# Altium schematic sheet usb_husb238a.SchDoc
size A
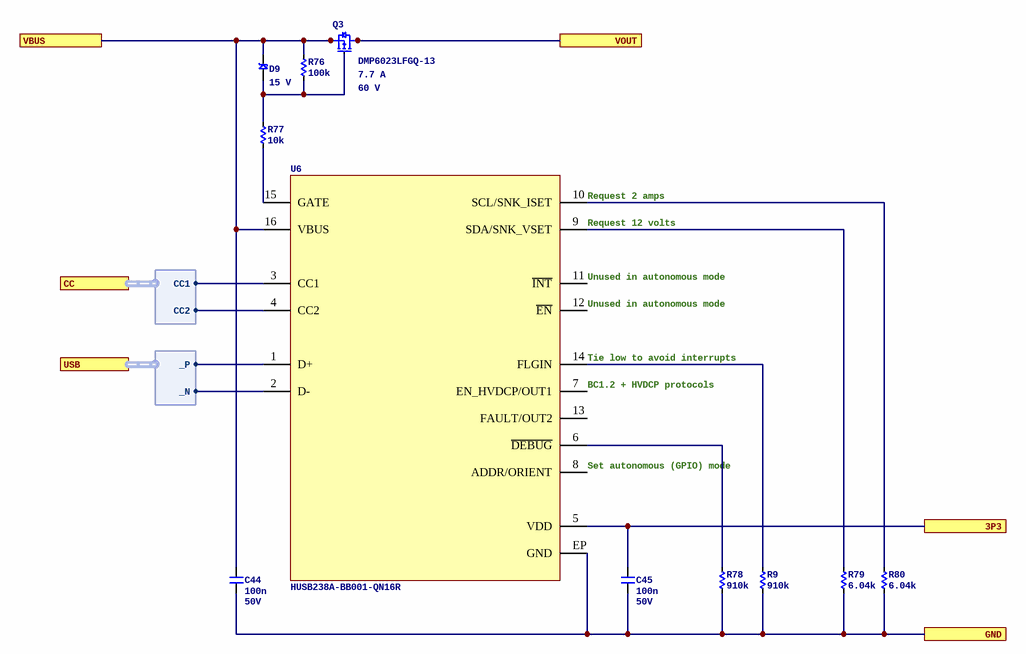
[diagram p0: usb_husb238a.SchDoc]

## Parts
C44  Capacitance: 100n  Voltage Rating: 50V  [C0402]  (hidden comment: CL05B104KB54PNC)
C45  Capacitance: 100n  Voltage Rating: 50V  [C0402]  (hidden comment: CL05B104KB54PNC)
D9  Voltage - Zener (Nom) (Vz): 15 V  [SOD323]  (hidden comment: MM3Z15VC)
Q3  DMP6023LFGQ-13  Current: 7.7 A  Voltage: 60 V  [DIODES_POWERDI3333-8]
R9  value 910k  [R0402]  (hidden comment: 0402WGF9103TCE)
R76  value 100k  [R0402]  (hidden comment: 0402WGF1003TCE)
R77  value 10k  [R0402]  (hidden comment: 0402WGF1002TCE)
R78  value 910k  [R0402]  (hidden comment: 0402WGF9103TCE)
R79  value 6.04k  [R0402]  (hidden comment: 0402WGF6041TCE)
R80  value 6.04k  [R0402]  (hidden comment: 0402WGF6041TCE)
U6  HUSB238A-BB001-QN16R  [QFN50P300X300X90-16N]

## Ports
3P3, CC (harness CC), GND, USB (harness DIFF), VBUS, VOUT

## Harnesses
CC: CC2, CC1
DIFF: _P, _N

## Nets
3P3: C45.1 U6.5(VDD) ; port 3P3
GND: C44.2 C45.2 R9.1 R78.1 R79.1 R80.1 U6.EP(GND) ; port GND
VBUS: C44.1 D9.2 Q3.1 Q3.2 Q3.3 R76.2 U6.16(VBUS) ; port VBUS
VOUT: Q3.5 Q3.6 Q3.7 Q3.8 ; port VOUT
NetD9_1: D9.1 Q3.4 R76.1 R77.2
NetR9_2: R9.2 U6.14(FLGIN)
NetR77_1: R77.1 U6.15(GATE)
NetR78_2: R78.2 U6.6(~{DEBUG})
NetR79_2: R79.2 U6.9(SDA/SNK_VSET)
NetR80_2: R80.2 U6.10(SCL/SNK_ISET)
NetU6_1: U6.1(D+) ; port USB._P
NetU6_2: U6.2(D-) ; port USB._N
NetU6_3: U6.3(CC1) ; port CC.CC1
NetU6_4: U6.4(CC2) ; port CC.CC2

Not connected (* = marked no-connect by the designer): U6 7(EN_HVDCP/OUT1) 8(ADDR/ORIENT) 11(~{INT}) 12(~{EN}) 13(FAULT/OUT2)

## Notes on the sheet
- (near U6) Request 2 amps
- (near U6) Request 12 volts
- (near U6) Unused in autonomous mode
- (near U6) BC1.2 + HVDCP protocols
- (near U6) Tie low to avoid interrupts
- (near U6) Set autonomous (GPIO) mode

## Library data of the parts
C44 C45 = CL05B104KB54PNC: Manufacturer: Samsung Electro-Mechanics; Dielectric: X7R; ComponentLink1URL: https://wmsc.lcsc.com/wmsc/upload/file/pdf/v2/lcsc/2304140030_Samsung-Electro-Mechanics-CL05B104KB54PNC_C307331.pdf; ComponentLink1Description: Datasheet; Manufacturer Part Number: CL05B104KB54PNC; Package: 0402; Supplier 2: LCSC; Supplier Part Number 2: C307331
D9 = ZENER_MM3Z15VC: DIODE ZENER 15V 200MW SOD; Manufacturer: onsemi; Supplier 1: Digikey; Manufacturer Part Number: MM3Z15VC; ComponentLink1URL: https://www.onsemi.com/pdf/datasheet/mm3z9v1c-d.pdf; ComponentLink1Description: Datasheet; Supplier Part Number 1: MM3Z15VCCT-ND; Supplier 2: LCSC; Supplier Part Number 2: C891582
Q3 = PFET_60V_DMP6023LFGQ-13: Small Signal Field-Effect Transistor, 7.7A I(D), 60V, 1-Element, P-Channel, Silicon, Metal-oxide Semiconductor FET; Manufacturer: Diodes; Supplier 1: Digikey; Supplier Part Number 1: 31-DMP6023LFGQ-13CT-ND; Manufacturer Part Number: DMP6023LFGQ-13; ComponentLink1Description: Datasheet; ComponentLink1URL: https://www.diodes.com/assets/Datasheets/DMP6023LFGQ.pdf; Supplier 2: LCSC; Supplier Part Number 2: C672173
R9 R78 = 0402WGF9103TCE: Manufacturer: UNI-ROYAL(Uniroyal Elec); Tolerance: 1%; Temperature Coefficient: Â±100ppm/â„ƒ; Power Rating (mW): 62.5; ComponentLink1Description: Datasheet; ComponentLink1URL: https://wmsc.lcsc.com/wmsc/upload/file/pdf/v2/lcsc/2206010045_UNI-ROYAL-Uniroyal-Elec-0402WGF9103TCE_C25800.pdf; Manufacturer Part Number: 0402WGF9103TCE; Package: 0402; Supplier 2: LCSC; Supplier Part Number 2: C25800
R76 = 0402WGF1003TCE: Manufacturer: UNI-ROYAL(Uniroyal Elec); Tolerance: 1%; Temperature Coefficient: Â±100ppm/â„ƒ; Power Rating (mW): 62.5; ComponentLink1Description: Datasheet; ComponentLink1URL: https://wmsc.lcsc.com/wmsc/upload/file/pdf/v2/lcsc/2206010100_UNI-ROYAL-Uniroyal-Elec-0402WGF1003TCE_C25741.pdf; Manufacturer Part Number: 0402WGF1003TCE; Package: 0402; Supplier 2: LCSC; Supplier Part Number 2: C25741
R77 = 0402WGF1002TCE: Manufacturer: UNI-ROYAL(Uniroyal Elec); Tolerance: 1%; Temperature Coefficient: Â±100ppm/â„ƒ; Power Rating (mW): 62.5; ComponentLink1Description: Datasheet; ComponentLink1URL: https://wmsc.lcsc.com/wmsc/upload/file/pdf/v2/lcsc/2206010100_UNI-ROYAL-Uniroyal-Elec-0402WGF1002TCE_C25744.pdf; Manufacturer Part Number: 0402WGF1002TCE; Package: 0402; Supplier 2: LCSC; Supplier Part Number 2: C25744
R79 R80 = 0402WGF6041TCE: Manufacturer: UNI-ROYAL(Uniroyal Elec); Tolerance: 1%; Temperature Coefficient: Â±100ppm/â„ƒ; Power Rating (mW): 62.5; ComponentLink1Description: Datasheet; ComponentLink1URL: https://wmsc.lcsc.com/wmsc/upload/file/pdf/v2/lcsc/2206010045_UNI-ROYAL-Uniroyal-Elec-0402WGF6041TCE_C25913.pdf; Manufacturer Part Number: 0402WGF6041TCE; Package: 0402; Supplier 2: LCSC; Supplier Part Number 2: C25913
U6 = USB_PD_HUSB238A: USB PD EPR SINK CONTROLLER WITH I2C; Manufacturer: Hynetek; Supplier 1: LCSC; Supplier Part Number 1: C24833806; Manufacturer Part Number: HUSB238A-BB001-QN16R; ComponentLink1Description: Datasheet; ComponentLink1URL: https://www.lcsc.com/datasheet/lcsc_datasheet_2412301710_Hynetek-HUSB238A-BB001-QN16R_C24833806.pdf; ComponentLink2Description: Product page; ComponentLink2URL: https://en.hynetek.com/2643.html